# EAGLE schematic ee40_robot_final_p2 (EAGLE 6.5.0)
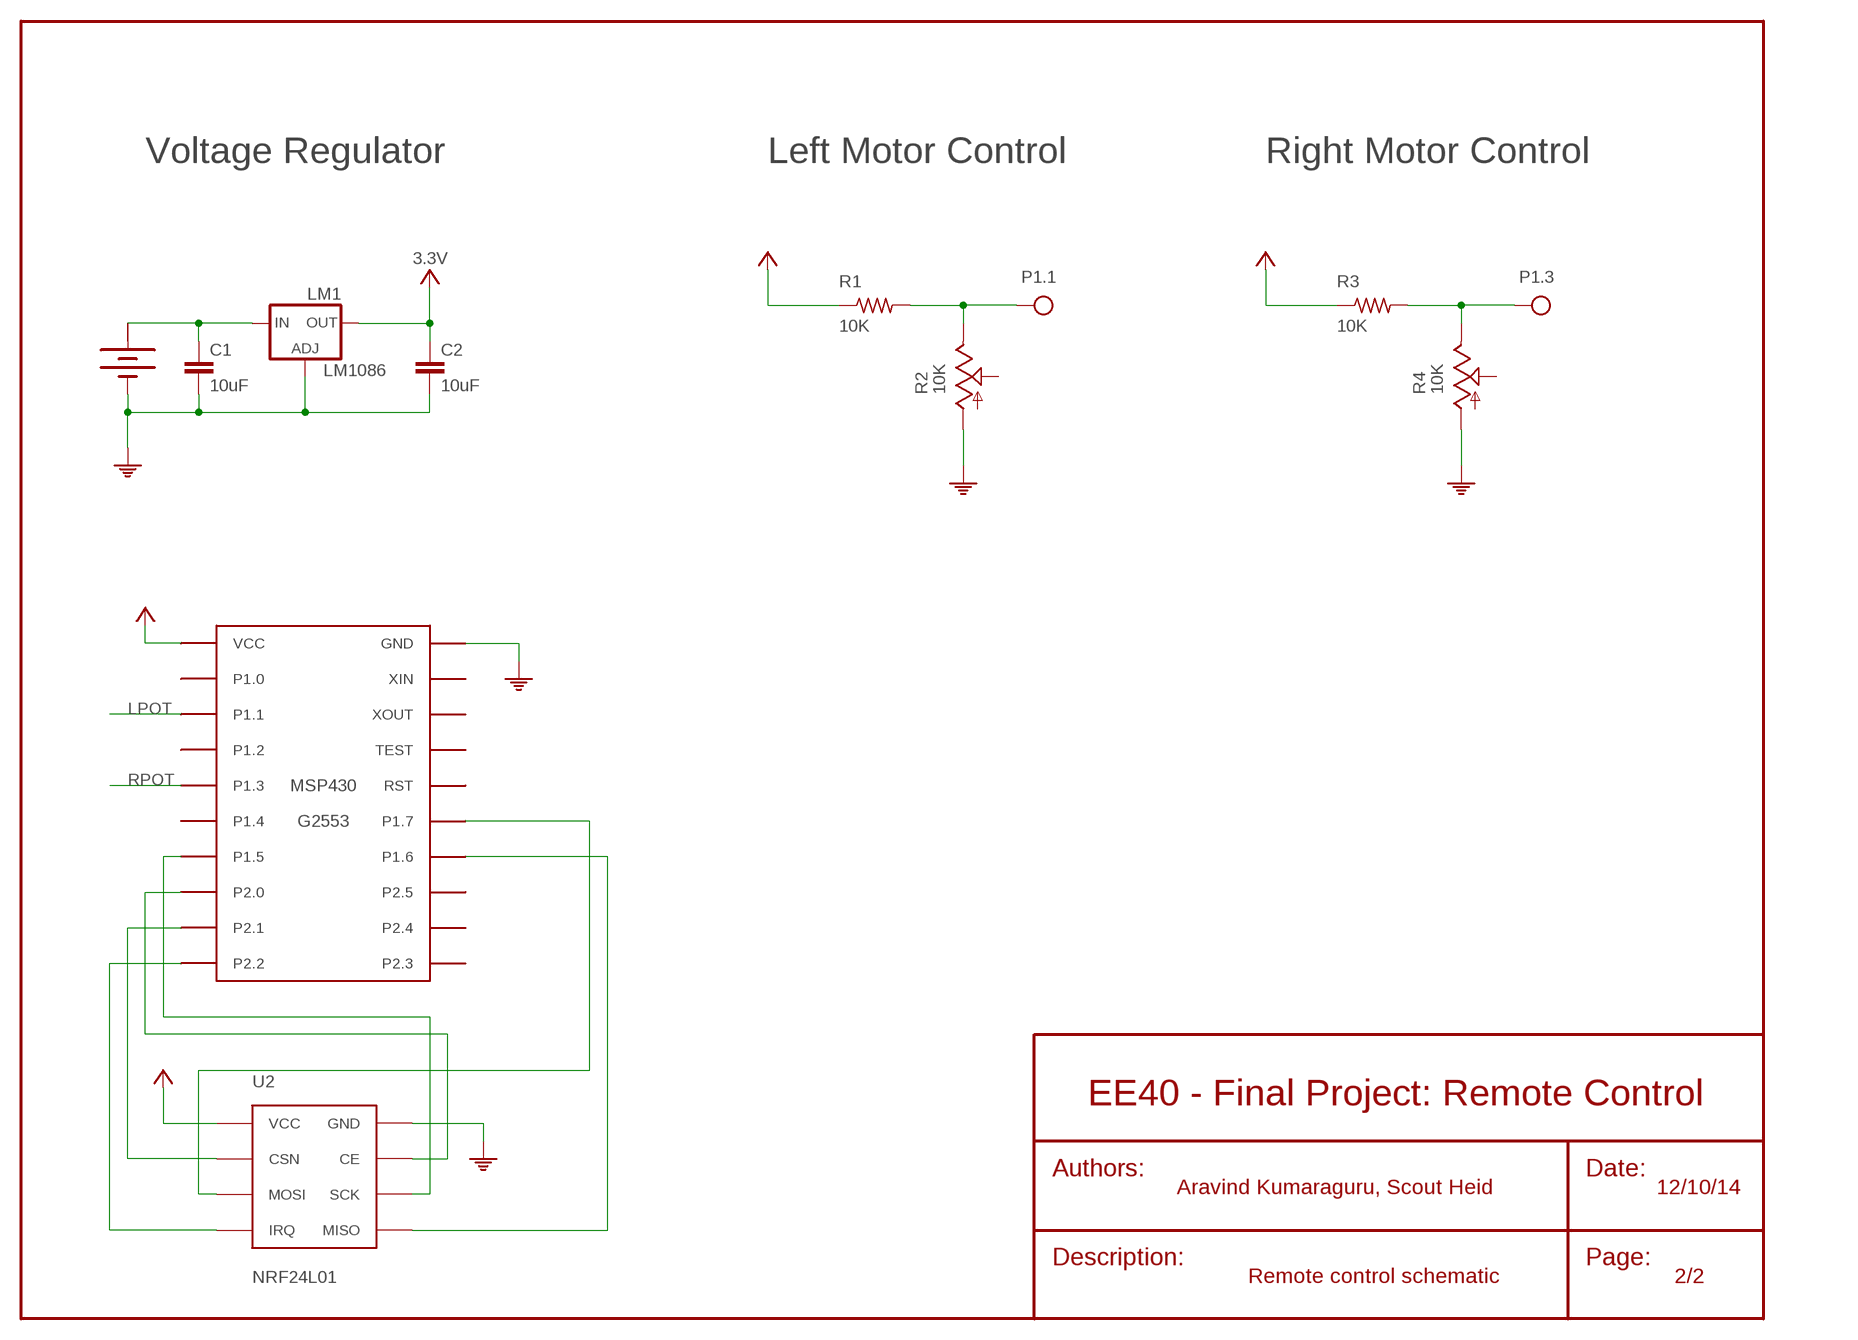
[diagram p0: schematic, sheet 1]

## Parts
BAT1  9V D-CELL  BATTERY  [BATTERY]
C1  10uF  C5/2.5  [C5B2.5]
C2  10uF  C5/2.5  [C5B2.5]
LM1  LM1086  LM138-TL  [TO220L1]
R1  10K  R-US_VMTA55  [VMTA55]
R2  10K  TRIM_US-RJ9W  [RJ9W]
R3  10K  R-US_VMTA55  [VMTA55]
R4  10K  TRIM_US-RJ9W  [RJ9W]
U1  MSP430  [MSP430]
U2  NRF24L01  [NRF24L01]

## Nets
9V: BAT1.+ C1.1 LM1.3(IN)
CE: U1.P$8(P2.0) U2.P$1(CE)
CSN: U1.P$9(P2.1) U2.P$2(CSN)
GND: BAT1.- C1.2 C2.2 LM1.1(ADJ) R2.A R4.A U1.P$20(GND) U2.P$3(GND)
IRQ: U1.P$10(P2.2) U2.P$4(IRQ)
LPOT: R1.2 R2.E U1.P$3(P1.1) ; supply symbol labelled P1.1
MISO: U1.P$14(P1.6) U2.P$5(MISO)
MOSI: U1.P$15(P1.7) U2.P$6(MOSI)
RPOT: R3.2 R4.E U1.P$5(P1.3) ; supply symbol labelled P1.3
SCK: U1.P$7(P1.5) U2.P$7(SCK)
VCC: C2.1 LM1.2(OUT) R1.1 R3.1 U1.P$1(VCC) U2.P$8(VCC) ; supply symbol labelled 3.3V
Unconnected: R2.S R4.S U1.P$2(P1.0) U1.P$4(P1.2) U1.P$6(P1.4) U1.P$11(P2.3) U1.P$12(P2.4) U1.P$13(P2.5) U1.P$16(RST) U1.P$17(TEST) U1.P$18(XOUT) U1.P$19(XIN)

## Notes on the sheet
- Voltage Regulator | Left Motor Control | Right Motor Control
- EE40 - Final Project: Remote Control
- Authors: | Date:
- Aravind Kumaraguru, Scout Heid | 12/10/14
- Description: | Page:
- Remote control schematic | 2/2

## Power pins joined to a net without a drawn wire
+: BAT1.+@1(+)

## Library data of the parts
BAT1 = special:BATTERY: BATTERY
C1 C2 = capacitor-wima:C: CAPACITOR naming: grid - package width
LM1 = v-reg:LM138-TL: VOLTAGE REGULATOR
R1 R3 = pie:R-US_: RESISTOR, American symbol; PIE-INT-REF-NUM: RESISTOR-GENERIC
R2 R4 = pot:TRIM_US-: POTENTIOMETER
U1 = ee40_robot:MSP430: MSP430-G2553 Microcontroller PinOuts
U2 = ee40_robot:NRF24L01